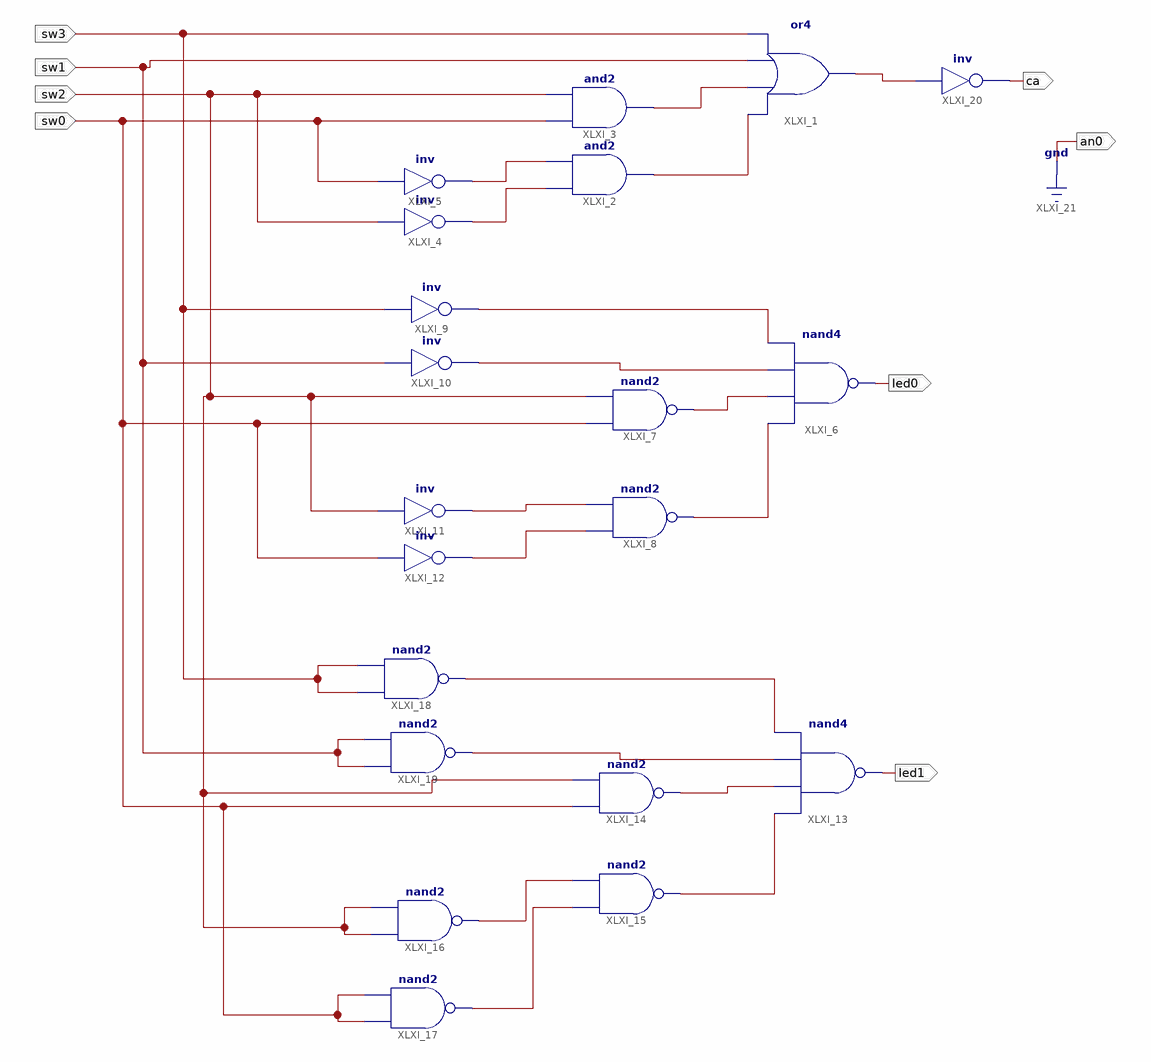
[diagram p0: schematic sheet 1]
// Xilinx ISE schematic lab42.sch (artix7) as structural Verilog: 20 symbols, 8 ports
module lab42 (
  input  sw1,
  input  sw0,
  input  sw2,
  input  sw3,
  output ca,
  output an0,
  output led0,
  output led1
);

  wire XLXN_1, XLXN_2, XLXN_3, XLXN_4, XLXN_9, XLXN_12, XLXN_13, XLXN_14, XLXN_15, XLXN_17, XLXN_18, XLXN_23,
       XLXN_24, XLXN_25, XLXN_26, XLXN_27, XLXN_28;

  or XLXI_1 (XLXN_9, XLXN_3, XLXN_4, sw1, sw3);
  and XLXI_2 (XLXN_3, XLXN_2, XLXN_1);
  and XLXI_3 (XLXN_4, sw0, sw2);
  not XLXI_4 (XLXN_2, sw2);
  not XLXI_5 (XLXN_1, sw0);
  nand XLXI_6 (led0, XLXN_15, XLXN_14, XLXN_13, XLXN_12);
  nand XLXI_7 (XLXN_14, sw0, sw2);
  nand XLXI_8 (XLXN_15, XLXN_18, XLXN_17);
  not XLXI_9 (XLXN_12, sw3);
  not XLXI_10 (XLXN_13, sw1);
  not XLXI_11 (XLXN_17, sw2);
  not XLXI_12 (XLXN_18, sw0);
  nand XLXI_13 (led1, XLXN_24, XLXN_23, XLXN_28, XLXN_27);
  nand XLXI_14 (XLXN_23, sw0, sw2);
  nand XLXI_15 (XLXN_24, XLXN_26, XLXN_25);
  nand XLXI_16 (XLXN_25, sw2, sw2);
  nand XLXI_17 (XLXN_26, sw0, sw0);
  nand XLXI_18 (XLXN_27, sw3, sw3);
  nand XLXI_19 (XLXN_28, sw1, sw1);
  not XLXI_20 (ca, XLXN_9);

  assign an0 = 1'b0;
endmodule
